# Altium project Infinity Disco Lights.PrjPcb
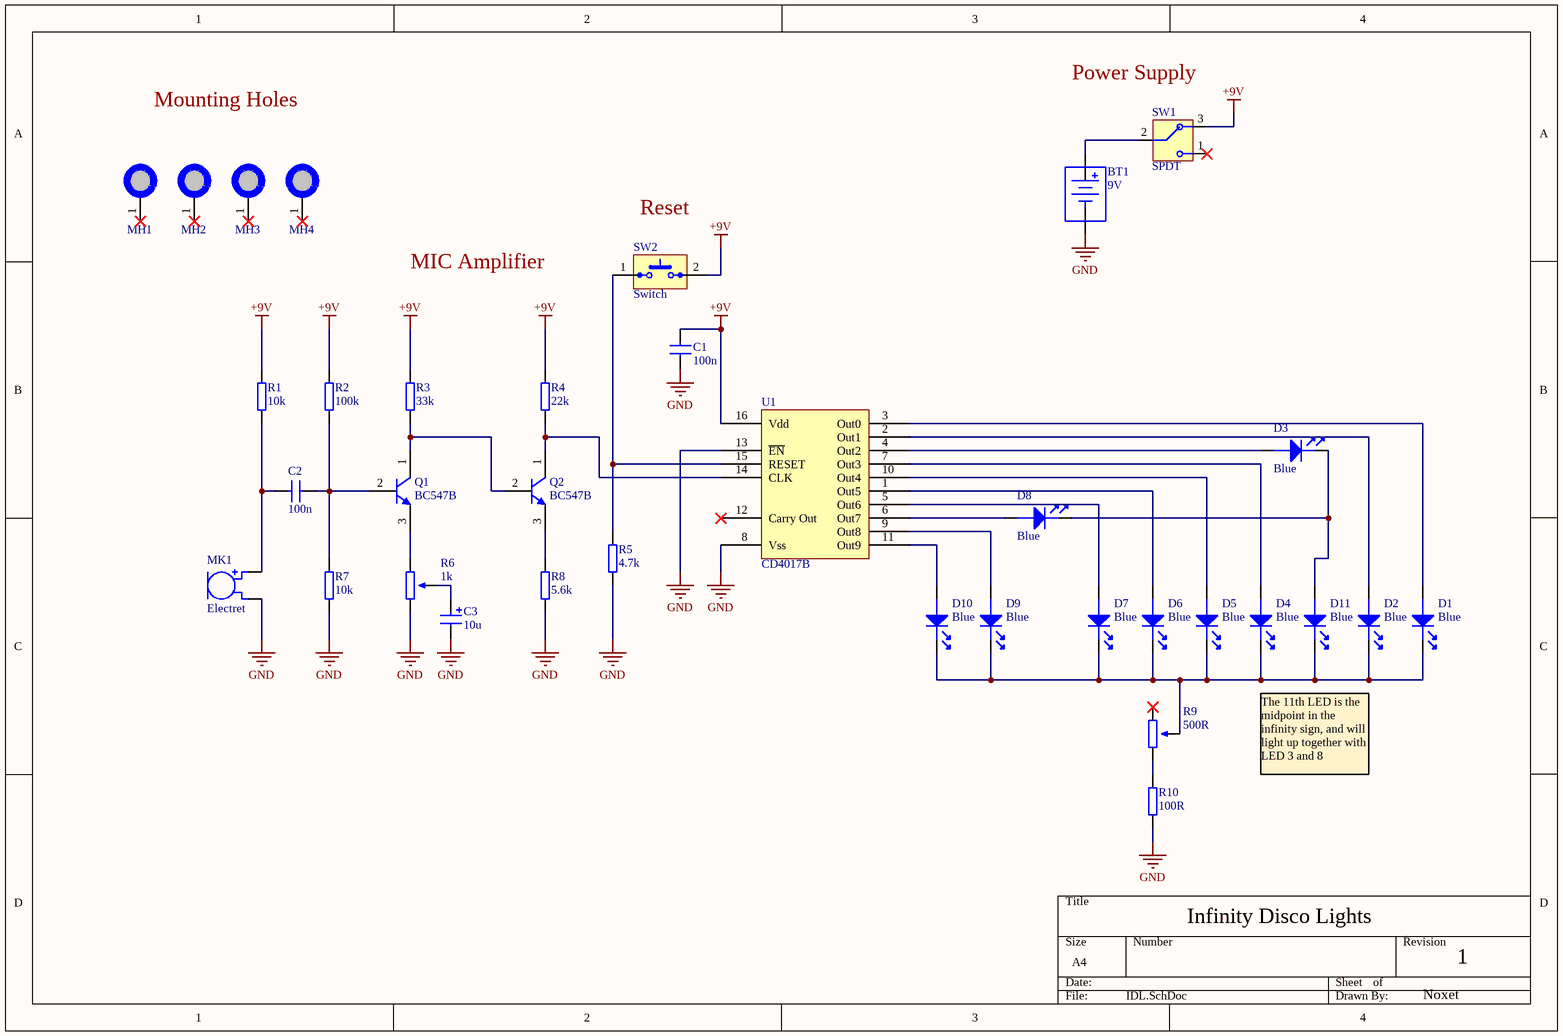
[diagram p0: IDL.SchDoc]
1 sheet, 35 parts. Net scope: global (net labels, ports and power ports of the same name join across sheets).
Board file: IDL.PcbDoc

## Sheet IDL.SchDoc: Infinity Disco Lights
size A4; Author: Noxet; DrawnBy: Noxet; Revision: 1; SheetNumber: 1; SheetTotal: 1

### Parts
BT1  9V  [Battery_Holder_9V]
C1  100n  [C_CERAMIC_TH_P5.08mm]
C2  100n  [C_CERAMIC_TH_P5.08mm]
C3  10u  [C_Radial_D6.3mm_H6mm_P2.5mm]
D1  Blue  [LED_Radial_10mm]
D2  Blue  [LED_Radial_10mm]
D3  Blue  [LED_Radial_10mm]
D4  Blue  [LED_Radial_10mm]
D5  Blue  [LED_Radial_10mm]
D6  Blue  [LED_Radial_10mm]
D7  Blue  [LED_Radial_10mm]
D8  Blue  [LED_Radial_10mm]
D9  Blue  [LED_Radial_10mm]
D10  Blue  [LED_Radial_10mm]
D11  Blue  [LED_Radial_10mm]
MH1  MH_M3_NPTH  [MH_M3_NPTH]  (value not drawn)  (no BOM)
MH2  MH_M3_NPTH  [MH_M3_NPTH]  (value not drawn)  (no BOM)
MH3  MH_M3_NPTH  [MH_M3_NPTH]  (value not drawn)  (no BOM)
MH4  MH_M3_NPTH  [MH_M3_NPTH]  (value not drawn)  (no BOM)
MK1  Electret  [ElectretMic_9.7mm_6.7mm]
Q1  BC547B  [BC547_TO-92_BENT]
Q2  BC547B  [BC547_TO-92_BENT]
R1  10k  [R_Axial_7.62mm]
R2  100k  [R_Axial_7.62mm]
R3  33k  [R_Axial_7.62mm]
R4  22k  [R_Axial_7.62mm]
R5  4.7k  [R_Axial_7.62mm]
R6  1k  [Trimpot_TH_P5.08mm]
R7  10k  [R_Axial_7.62mm]
R8  5.6k  [R_Axial_7.62mm]
R9  500R  [Trimpot_TH_P5.08mm]
R10  100R  [R_Axial_7.62mm]
SW1  SPDT  [SW_SPDT_SMTS-102-A2]
SW2  Switch  [SW_Tactile_2pin_P5.08mm]
U1  CD4017B  [DIP16_W7.62mm_P2.54mm]

### Nets
+9V: C1.2 R1.2 R2.2 R3.2 R4.2 SW1.3 SW2.2 U1.16(Vdd)
GND: BT1.N(NEG) C1.1 C3.2 MK1.2 R5.1 R6.1 R7.1 R8.1 R10.1 U1.8(Vss) U1.13(~{EN})
NetBT1_P: BT1.P(POS) SW1.2
NetC2_1: C2.1 MK1.1 R1.1
NetC2_2: C2.2 Q1.2(B) R2.1 R7.2
NetC3_1: C3.1 R6.2
NetD1_1: D1.1(An) U1.3(Out0)
NetD1_2: D1.2(Cat) D2.2(Cat) D4.2(Cat) D5.2(Cat) D6.2(Cat) D7.2(Cat) D9.2(Cat) D10.2(Cat) D11.2(Cat) R9.2
NetD2_1: D2.1(An) U1.2(Out1)
NetD3_1: D3.1(An) U1.4(Out2)
NetD3_2: D3.2(Cat) D8.2(Cat) D11.1(An)
NetD4_1: D4.1(An) U1.7(Out3)
NetD5_1: D5.1(An) U1.10(Out4)
NetD6_1: D6.1(An) U1.1(Out5)
NetD7_1: D7.1(An) U1.5(Out6)
NetD8_1: D8.1(An) U1.6(Out7)
NetD9_1: D9.1(An) U1.9(Out8)
NetD10_1: D10.1(An) U1.11(Out9)
NetQ1_1: Q1.1(C) Q2.2(B) R3.1
NetQ1_3: Q1.3(E) R6.3
NetQ2_1: Q2.1(C) R4.1 U1.14(CLK)
NetQ2_3: Q2.3(E) R8.2
NetR5_2: R5.2 SW2.1 U1.15(RESET)
NetR9_1: R9.1 R10.2

Not connected (* = marked no-connect by the designer): MH1 1*; MH2 1*; MH3 1*; MH4 1*; R9 3*; SW1 1*; U1 12(Carry_Out)*

### Notes on the sheet
- Mounting Holes
- (near SW1) Power Supply
- Reset
- MIC Amplifier
- The 11th LED is the midpoint in the infinity sign, and will light up together with LED 3 and 8

### Library data of the parts
BT1 = Battery Holder 9v: Electrokit art nr: 41003388
C1 C2 = Cap Ceramic
C3 = Cap TH Polarized: D6.3mm H6mm P2.5mm
D1-D11 = LED, TH
MK1 = Electret Mic: D9.7mm H6.7mm, Electrokit art nr: 40290007
Q1 Q2 = BJT NPN: BJT NPN in CBE  configuration
R1-R5 R7 R8 R10 = Resistor TH: Axial P7.62mm
R6 R9 = Pot TH: Trimpot TH 3386P
SW1 = Toggle switch SPDT
SW2 = Tactile switch 2 pin: 2-pin tactile button switch
U1 = CD4017B: Decade counter